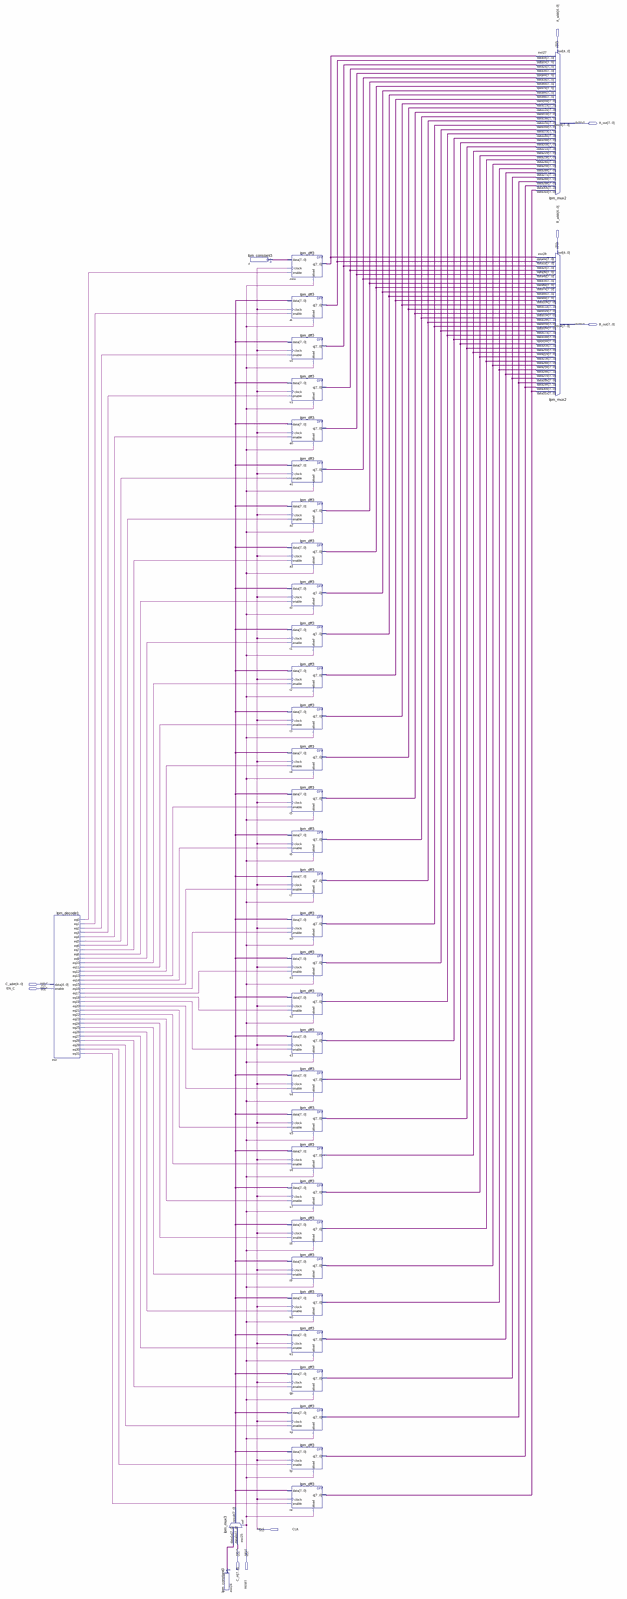
[diagram p0: schematic sheet, whole]
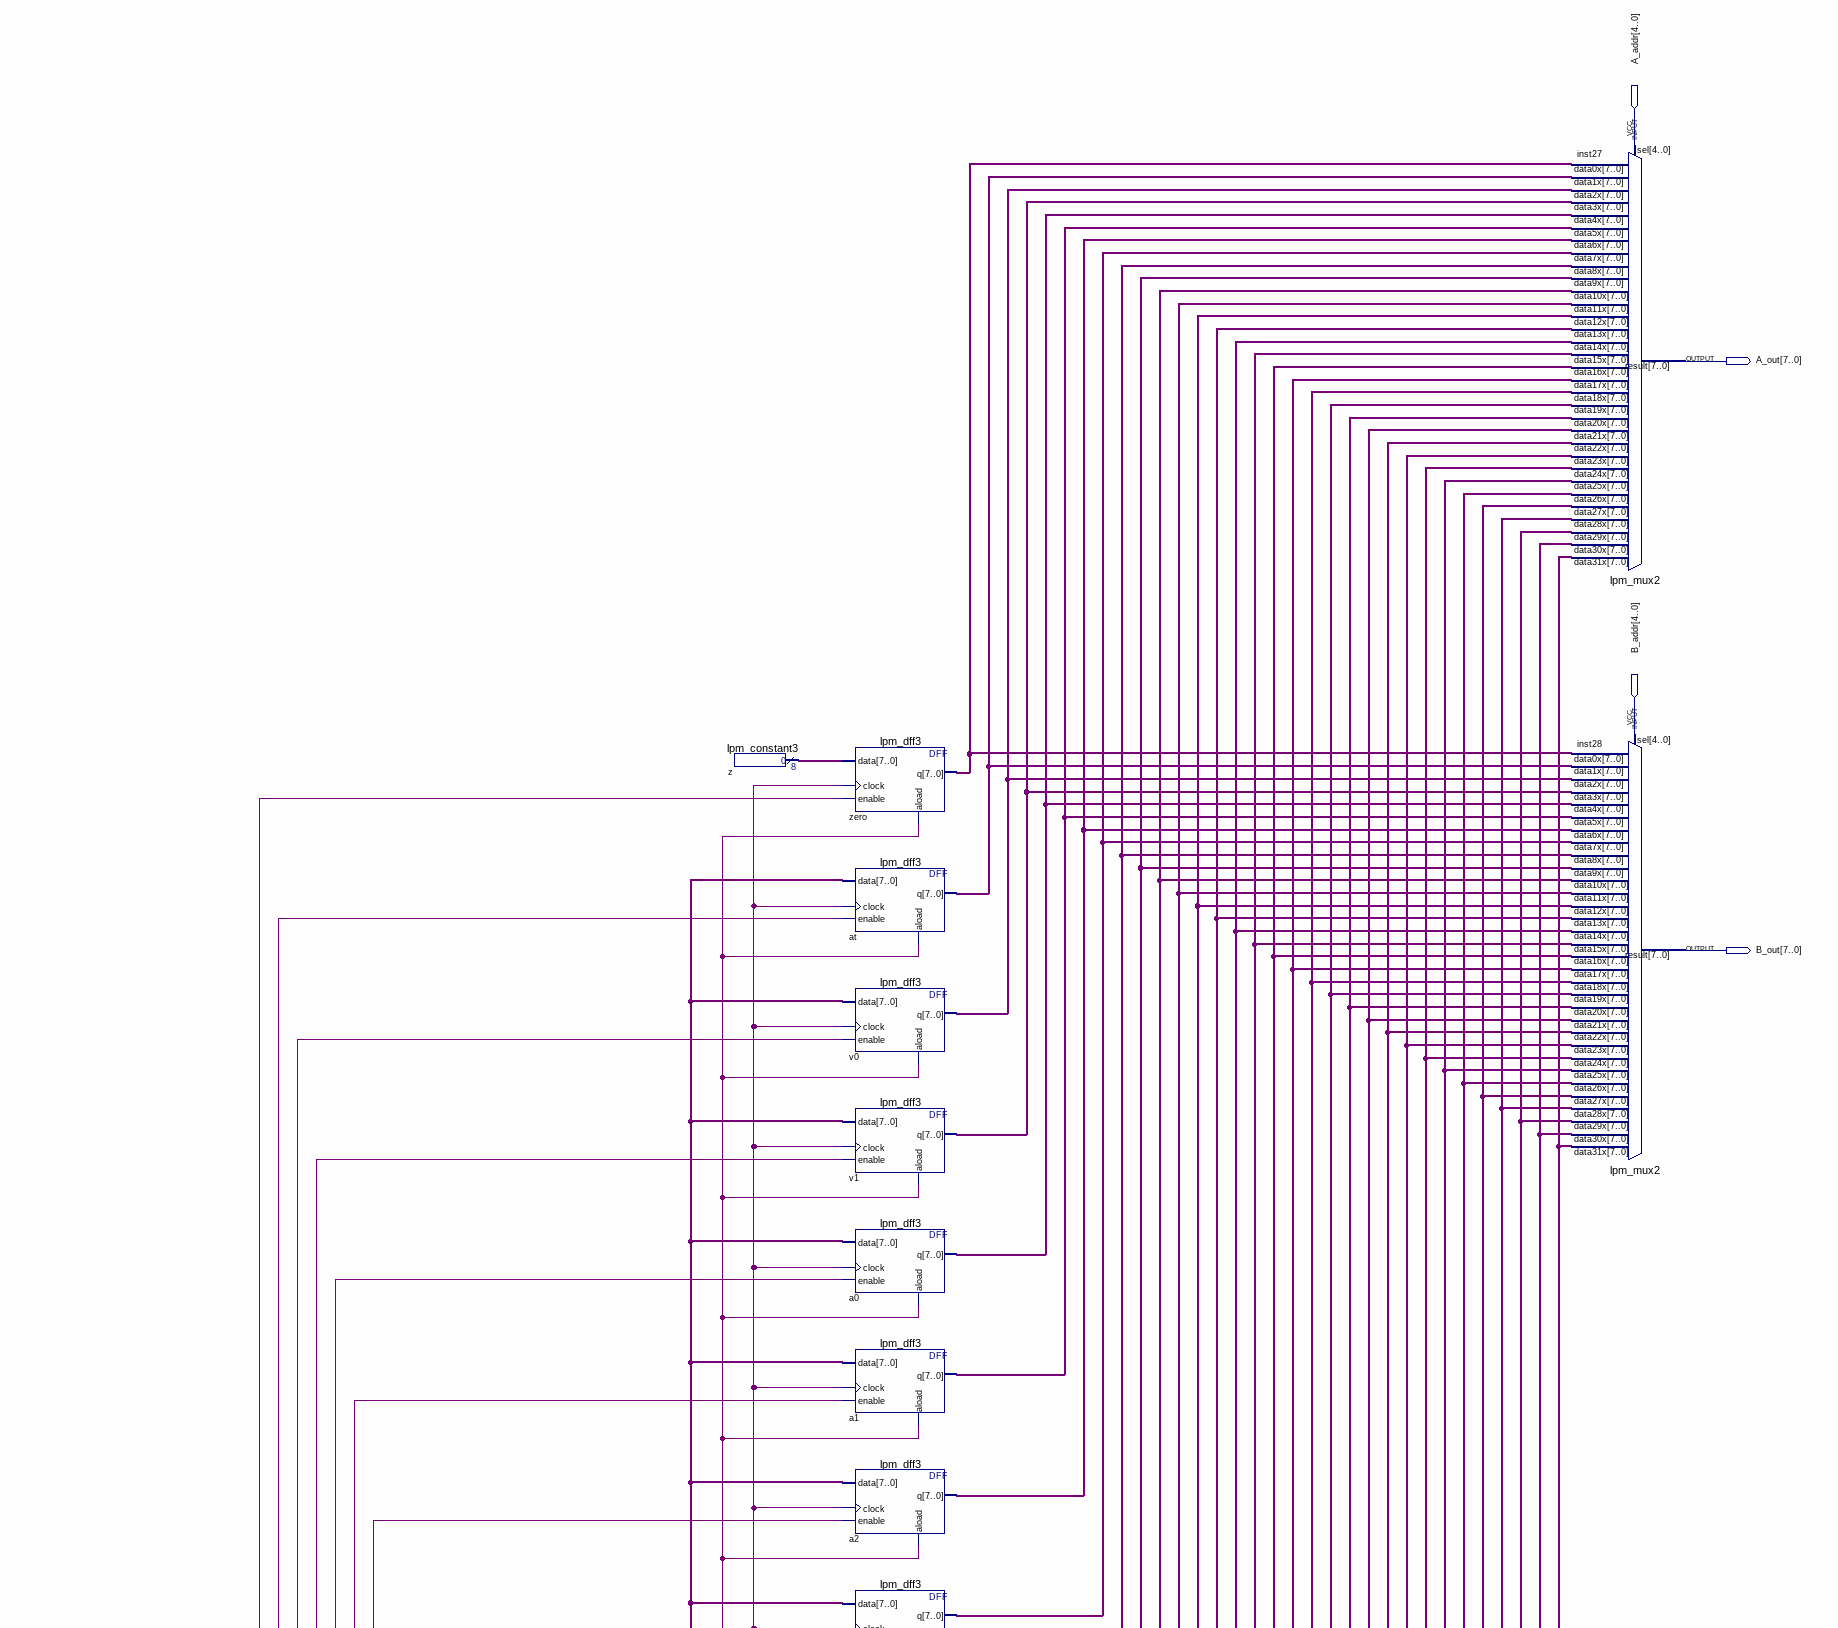
[diagram p1: schematic sheet, upper part]
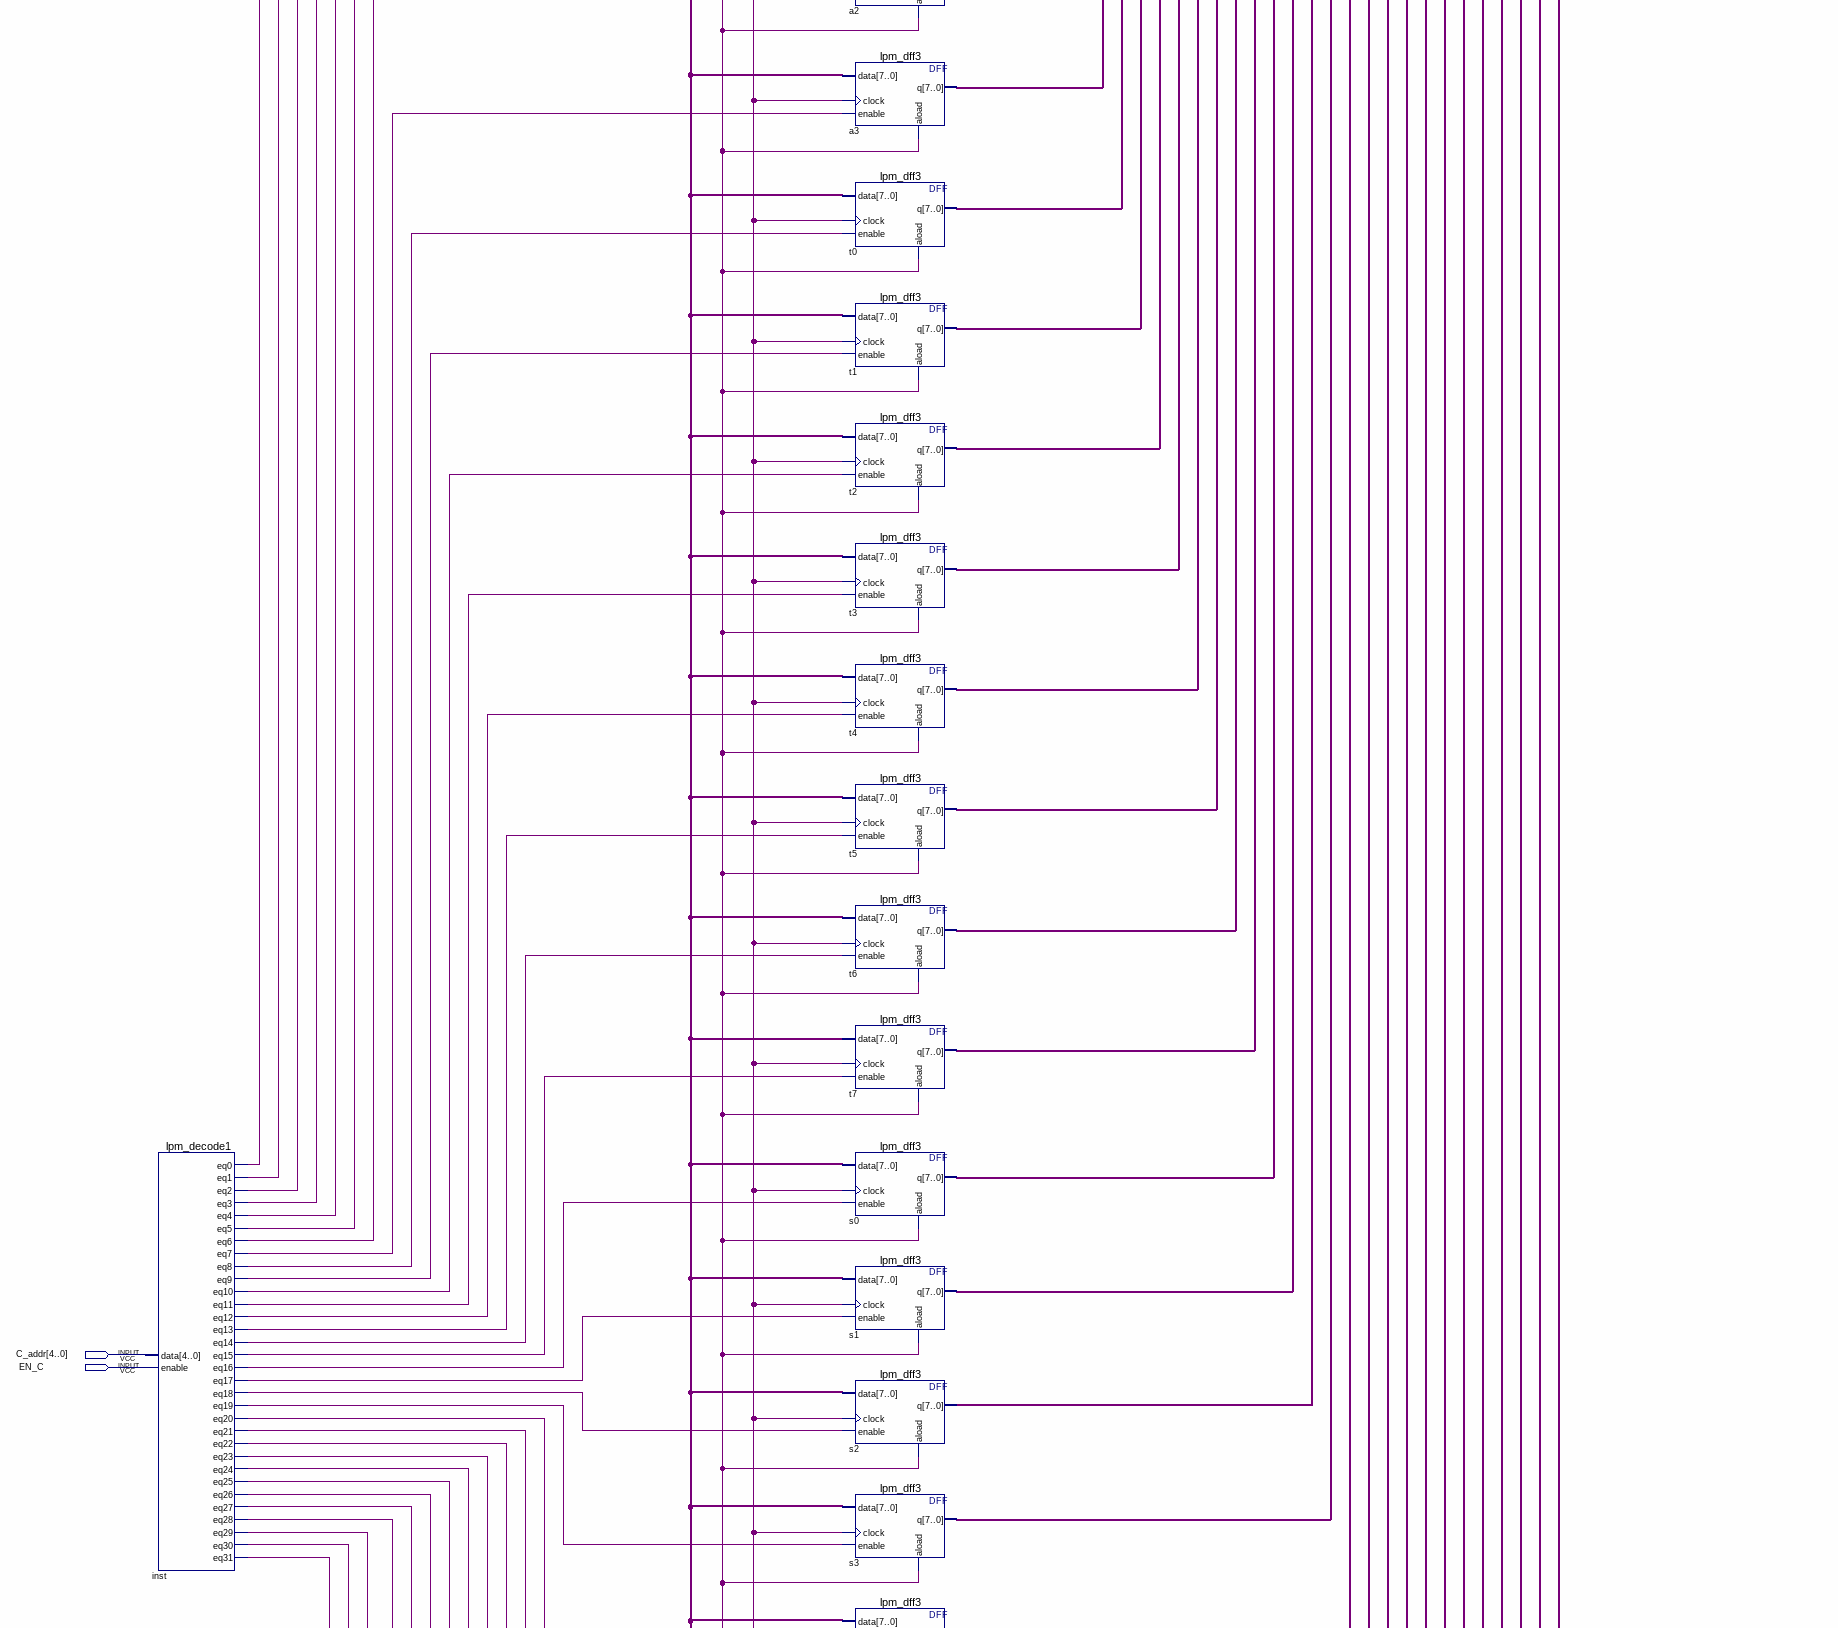
[diagram p2: schematic sheet, middle part]
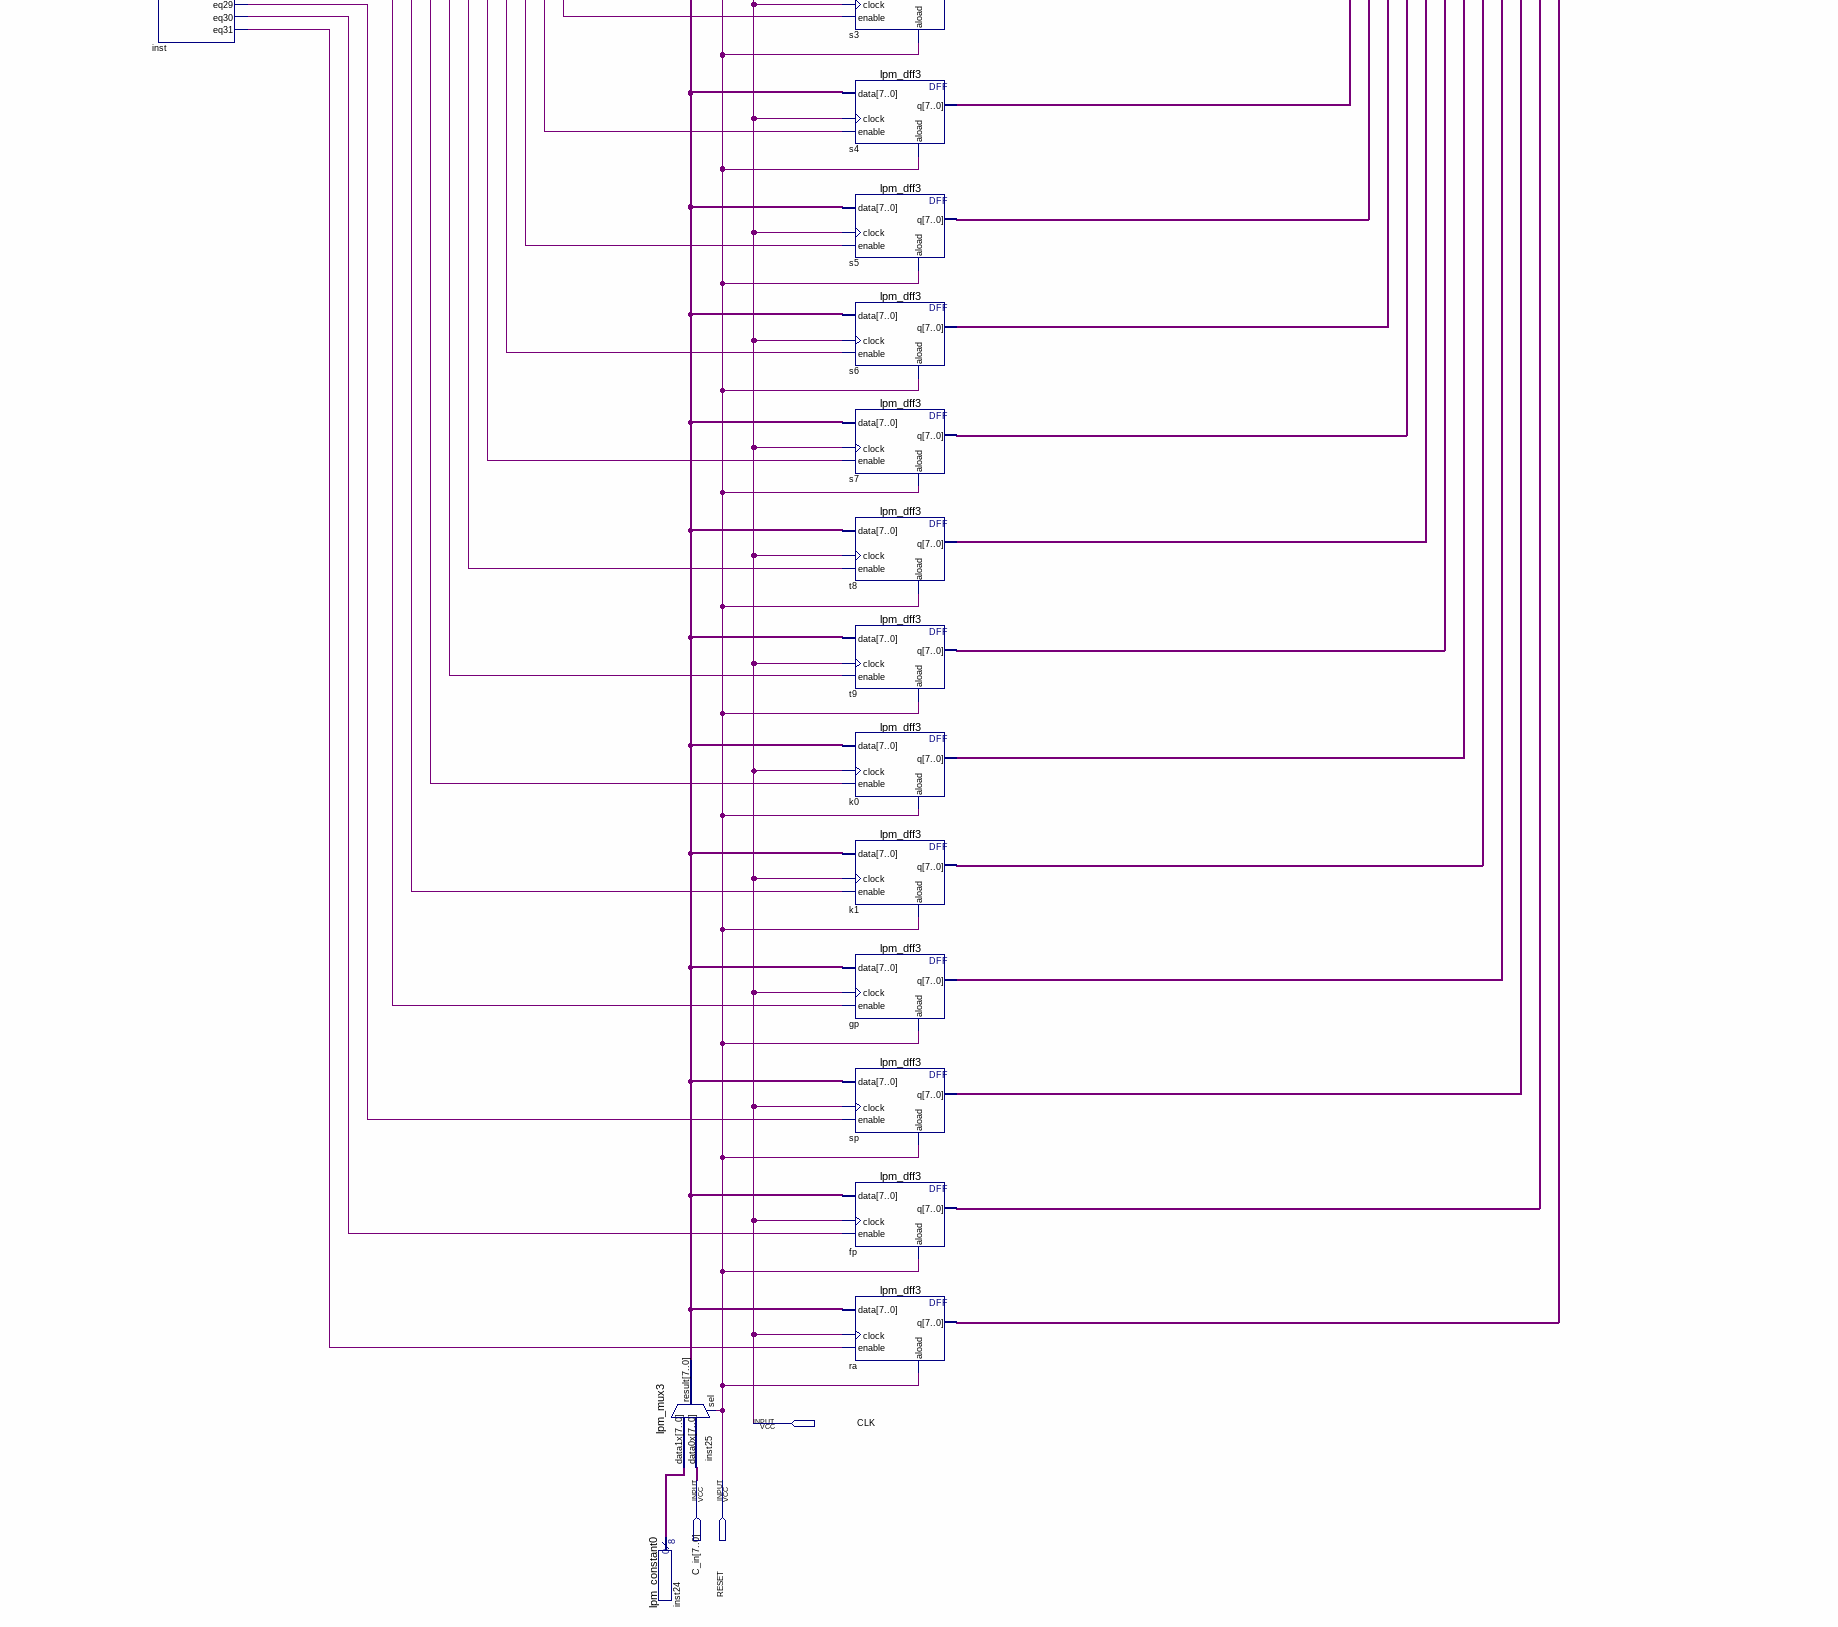
[diagram p3: schematic sheet, lower part]
// Quartus schematic regfile.bdf as structural Verilog: 38 symbols, 9 pins
module regfile (
  input  [4:0] A_addr,
  input  [4:0] B_addr,
  input  [4:0] C_addr,
  input  EN_C,
  input  CLK,
  input  [7:0] C_in,
  input  RESET,
  output [7:0] A_out,
  output [7:0] B_out
);

  wire inst_eq0, inst_eq1, inst_eq2, inst_eq3, inst_eq4, inst_eq5, inst_eq6, inst_eq7, inst_eq8, inst_eq9,
       inst_eq10, inst_eq11, inst_eq12, inst_eq13, inst_eq14, inst_eq15, inst_eq16, inst_eq17, inst_eq18,
       inst_eq19, inst_eq20, inst_eq21, inst_eq22, inst_eq23, inst_eq24, inst_eq25, inst_eq26, inst_eq27,
       inst_eq28, inst_eq29, inst_eq30, inst_eq31;
  wire [7:0] a0_q, a1_q, a2_q, a3_q, at_q, fp_q, gp_q, inst24_result, inst25_result, k0_q, k1_q, ra_q, s0_q,
       s1_q, s2_q, s3_q, s4_q, s5_q, s6_q, s7_q, sp_q, t0_q, t1_q, t2_q, t3_q, t4_q, t5_q, t6_q, t7_q, t8_q,
       t9_q, v0_q, v1_q, z_result, zero_q;

  lpm_decode1 inst (
    .data(C_addr), .enable(EN_C), .eq0(inst_eq0), .eq1(inst_eq1), .eq2(inst_eq2), .eq3(inst_eq3),
    .eq4(inst_eq4), .eq5(inst_eq5), .eq6(inst_eq6), .eq7(inst_eq7), .eq8(inst_eq8), .eq9(inst_eq9),
    .eq10(inst_eq10), .eq11(inst_eq11), .eq12(inst_eq12), .eq13(inst_eq13), .eq14(inst_eq14),
    .eq15(inst_eq15), .eq16(inst_eq16), .eq17(inst_eq17), .eq18(inst_eq18), .eq19(inst_eq19),
    .eq20(inst_eq20), .eq21(inst_eq21), .eq22(inst_eq22), .eq23(inst_eq23), .eq24(inst_eq24),
    .eq25(inst_eq25), .eq26(inst_eq26), .eq27(inst_eq27), .eq28(inst_eq28), .eq29(inst_eq29),
    .eq30(inst_eq30), .eq31(inst_eq31));
  lpm_constant0 inst24 (.result(inst24_result));
  lpm_mux3 inst25 (.data1x(inst24_result), .data0x(C_in), .sel(RESET), .result(inst25_result));
  lpm_constant3 z (.result(z_result));
  lpm_dff3 zero (.data(z_result), .clock(CLK), .enable(inst_eq0), .aload(RESET), .q(zero_q));
  lpm_dff3 at (.data(inst25_result), .clock(CLK), .enable(inst_eq1), .aload(RESET), .q(at_q));
  lpm_dff3 v0 (.data(inst25_result), .clock(CLK), .enable(inst_eq2), .aload(RESET), .q(v0_q));
  lpm_dff3 v1 (.data(inst25_result), .clock(CLK), .enable(inst_eq3), .aload(RESET), .q(v1_q));
  lpm_dff3 a0 (.data(inst25_result), .clock(CLK), .enable(inst_eq4), .aload(RESET), .q(a0_q));
  lpm_dff3 a1 (.data(inst25_result), .clock(CLK), .enable(inst_eq5), .aload(RESET), .q(a1_q));
  lpm_dff3 a2 (.data(inst25_result), .clock(CLK), .enable(inst_eq6), .aload(RESET), .q(a2_q));
  lpm_dff3 a3 (.data(inst25_result), .clock(CLK), .enable(inst_eq7), .aload(RESET), .q(a3_q));
  lpm_dff3 t0 (.data(inst25_result), .clock(CLK), .enable(inst_eq8), .aload(RESET), .q(t0_q));
  lpm_dff3 t1 (.data(inst25_result), .clock(CLK), .enable(inst_eq9), .aload(RESET), .q(t1_q));
  lpm_dff3 t2 (.data(inst25_result), .clock(CLK), .enable(inst_eq10), .aload(RESET), .q(t2_q));
  lpm_dff3 t3 (.data(inst25_result), .clock(CLK), .enable(inst_eq11), .aload(RESET), .q(t3_q));
  lpm_dff3 t4 (.data(inst25_result), .clock(CLK), .enable(inst_eq12), .aload(RESET), .q(t4_q));
  lpm_dff3 t5 (.data(inst25_result), .clock(CLK), .enable(inst_eq13), .aload(RESET), .q(t5_q));
  lpm_dff3 t6 (.data(inst25_result), .clock(CLK), .enable(inst_eq14), .aload(RESET), .q(t6_q));
  lpm_dff3 t7 (.data(inst25_result), .clock(CLK), .enable(inst_eq15), .aload(RESET), .q(t7_q));
  lpm_dff3 s0 (.data(inst25_result), .clock(CLK), .enable(inst_eq16), .aload(RESET), .q(s0_q));
  lpm_dff3 s1 (.data(inst25_result), .clock(CLK), .enable(inst_eq17), .aload(RESET), .q(s1_q));
  lpm_dff3 s2 (.data(inst25_result), .clock(CLK), .enable(inst_eq18), .aload(RESET), .q(s2_q));
  lpm_dff3 s3 (.data(inst25_result), .clock(CLK), .enable(inst_eq19), .aload(RESET), .q(s3_q));
  lpm_dff3 s4 (.data(inst25_result), .clock(CLK), .enable(inst_eq20), .aload(RESET), .q(s4_q));
  lpm_dff3 s5 (.data(inst25_result), .clock(CLK), .enable(inst_eq21), .aload(RESET), .q(s5_q));
  lpm_dff3 s6 (.data(inst25_result), .clock(CLK), .enable(inst_eq22), .aload(RESET), .q(s6_q));
  lpm_dff3 s7 (.data(inst25_result), .clock(CLK), .enable(inst_eq23), .aload(RESET), .q(s7_q));
  lpm_dff3 t8 (.data(inst25_result), .clock(CLK), .enable(inst_eq24), .aload(RESET), .q(t8_q));
  lpm_dff3 t9 (.data(inst25_result), .clock(CLK), .enable(inst_eq25), .aload(RESET), .q(t9_q));
  lpm_dff3 k0 (.data(inst25_result), .clock(CLK), .enable(inst_eq26), .aload(RESET), .q(k0_q));
  lpm_dff3 k1 (.data(inst25_result), .clock(CLK), .enable(inst_eq27), .aload(RESET), .q(k1_q));
  lpm_dff3 gp (.data(inst25_result), .clock(CLK), .enable(inst_eq28), .aload(RESET), .q(gp_q));
  lpm_dff3 sp (.data(inst25_result), .clock(CLK), .enable(inst_eq29), .aload(RESET), .q(sp_q));
  lpm_dff3 fp (.data(inst25_result), .clock(CLK), .enable(inst_eq30), .aload(RESET), .q(fp_q));
  lpm_dff3 ra (.data(inst25_result), .clock(CLK), .enable(inst_eq31), .aload(RESET), .q(ra_q));
  lpm_mux2 inst27 (
    .data31x(ra_q), .data30x(fp_q), .data29x(sp_q), .data28x(gp_q), .data27x(k1_q), .data26x(k0_q),
    .data25x(t9_q), .data24x(t8_q), .data23x(s7_q), .data22x(s6_q), .data21x(s5_q), .data20x(s4_q),
    .data19x(s3_q), .data18x(s2_q), .data17x(s1_q), .data16x(s0_q), .data15x(t7_q), .data14x(t6_q),
    .data13x(t5_q), .data12x(t4_q), .data11x(t3_q), .data10x(t2_q), .data9x(t1_q), .data8x(t0_q),
    .data7x(a3_q), .data6x(a2_q), .data5x(a1_q), .data4x(a0_q), .data3x(v1_q), .data2x(v0_q), .data1x(at_q),
    .data0x(zero_q), .sel(A_addr), .result(A_out));
  lpm_mux2 inst28 (
    .data31x(ra_q), .data30x(fp_q), .data29x(sp_q), .data28x(gp_q), .data27x(k1_q), .data26x(k0_q),
    .data25x(t9_q), .data24x(t8_q), .data23x(s7_q), .data22x(s6_q), .data21x(s5_q), .data20x(s4_q),
    .data19x(s3_q), .data18x(s2_q), .data17x(s1_q), .data16x(s0_q), .data15x(t7_q), .data14x(t6_q),
    .data13x(t5_q), .data12x(t4_q), .data11x(t3_q), .data10x(t2_q), .data9x(t1_q), .data8x(t0_q),
    .data7x(a3_q), .data6x(a2_q), .data5x(a1_q), .data4x(a0_q), .data3x(v1_q), .data2x(v0_q), .data1x(at_q),
    .data0x(zero_q), .sel(B_addr), .result(B_out));
endmodule
